# Altium schematic sheet mbed-enablement-platform_F_2.SchDoc: Mbed EP - DAPLink
size A4; Date: 10/26/2017 12:01:20 PM; Revision: Firefly; SheetNumber: 2; SheetTotal: 4
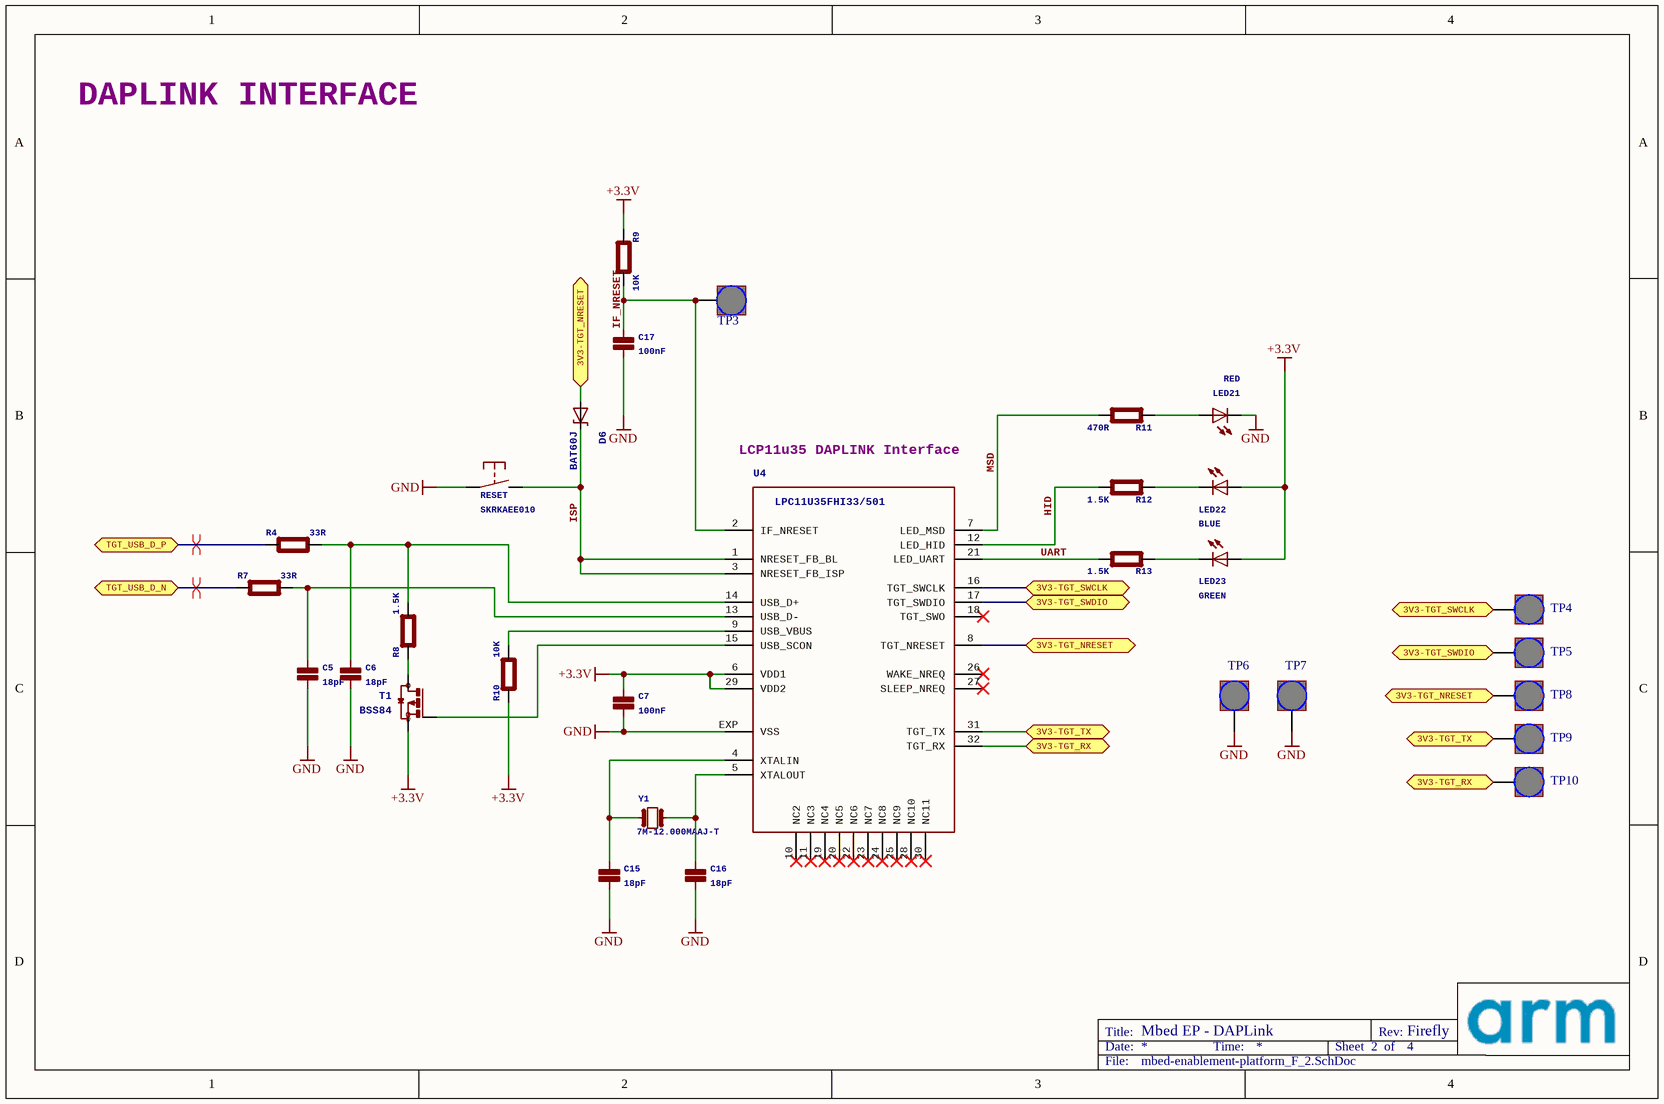
[diagram p0: mbed-enablement-platform_F_2.SchDoc]

## Parts
C5  18pF  [0402]
C6  18pF  [0402]
C7  100nF  [0402]
C15  18pF  [0402]
C16  18pF  [0402]
C17  100nF  [0402]
D6  BAT60J  [SOD323]
LED21  RED  [CHIPLED_0603]
LED22  BLUE  [CHIPLED_0603]
LED23  GREEN  [CHIPLED_0603]
R4  33R  [0402]
R7  33R  [0402]
R8  1.5K  [0402]
R9  10K  [0402]
R10  10K  [0402]
R11  470R  [0402]
R12  1.5K  [0402]
R13  1.5K  [0402]
RESET  SKRKAEE010  [SKRKAEE010]
T1  BSS84  [SOT23-3]
TP3  TP, 1.5mm  [TP1.5]  (value not drawn)
TP4  TP, 1.5mm  [TP1.5]  (value not drawn)
TP5  TP, 1.5mm  [TP1.5]  (value not drawn)
TP6  TP, 1.5mm  [TP1.5]  (value not drawn)
TP7  TP, 1.5mm  [TP1.5]  (value not drawn)
TP8  TP, 1.5mm  [TP1.5]  (value not drawn)
TP9  TP, 1.5mm  [TP1.5]  (value not drawn)
TP10  TP, 1.5mm  [TP1.5]  (value not drawn)
U4  IF_LPC11U35FHI33/501  [HVQFN33]  (value not drawn)
Y1  7M-12.000MAAJ-T  [3.2X.2.5]

## Ports
3V3-TGT_NRESET, 3V3-TGT_RX, 3V3-TGT_SWCLK, 3V3-TGT_SWDIO, 3V3-TGT_TX, TGT_USB_D_N (bidir), TGT_USB_D_P (bidir)

## Nets
+3.3V: C7.1(P$1) LED22.A LED23.A R9.1(P$1) R10.1(P$1) T1.2(S) U4.6(VDD1) U4.29(VDD2)
GND: C5.2(P$2) C6.2(P$2) C7.2(P$2) C15.2(P$2) C16.2(P$2) C17.2(P$2) LED21.C RESET.P$1(P) TP6.1 TP7.1 U4.EXP(VSS)
3V3-TGT_NRESET: D6.A TP8.1 U4.8(TGT_NRESET) ; port 3V3-TGT_NRESET
3V3-TGT_RX: TP10.1 U4.32(TGT_RX) ; port 3V3-TGT_RX
3V3-TGT_SWCLK: TP4.1 U4.16(TGT_SWCLK) ; port 3V3-TGT_SWCLK
3V3-TGT_SWDIO: TP5.1 U4.17(TGT_SWDIO) ; port 3V3-TGT_SWDIO
3V3-TGT_TX: TP9.1 U4.31(TGT_TX) ; port 3V3-TGT_TX
HID: R12.2(P$2) U4.12(LED_HID)
IF_NRESET: C17.1(P$1) R9.2(P$2) TP3.1 U4.2(IF_NRESET)
ISP: D6.K RESET.P$2(S) U4.1(NRESET_FB_BL) U4.3(NRESET_FB_ISP)
MSD: R11.2(P$2) U4.7(LED_MSD)
TGT_USB_D_N: R7.1(P$1) ; port TGT_USB_D_N
TGT_USB_D_P: R4.1(P$1) ; port TGT_USB_D_P
UART: R13.2(P$2) U4.21(LED_UART)
NetC5_1: C5.1(P$1) R7.2(P$2) U4.13(USB_D-)
NetC6_1: C6.1(P$1) R4.2(P$2) R8.2(P$2) U4.14(USB_D+)
NetC15_1: C15.1(P$1) U4.4(XTALIN) Y1.P$1
NetC16_1: C16.1(P$1) U4.5(XTALOUT) Y1.P$3
NetLED21_A: LED21.A R11.1(P$1)
NetLED22_C: LED22.C R12.1(P$1)
NetLED23_C: LED23.C R13.1(P$1)
NetR8_1: R8.1(P$1) T1.3(D)
NetR10_2: R10.2(P$2) U4.9(USB_VBUS)
NetT1_1: T1.1(G) U4.15(USB_SCON)

Not connected (* = marked no-connect by the designer): U4 10(NC2)* 11(NC3)* 18(TGT_SWO)* 19(NC4)* 20(NC5)* 22(NC6)* 23(NC7)* 24(NC8)* 25(NC9)* 26(WAKE_NREQ)* 27(SLEEP_NREQ)* 28(NC10)* 30(NC11)*

## Layout directives
differential pair: TGT_USB_D_N, TGT_USB_D_P

## Notes on the sheet
- DAPLINK INTERFACE
- LCP11u35 DAPLINK Interface
- Title:
- Date:
- Time:
- Sheet
- Rev:
- of
- File:

## Library data of the parts
C5-C7 C15-C17 = CAPACITOR0402: Capacitor
D6 = BAT60J: SCHOTTKY DIODE; MF: STMicroelectronics; MFN: BAT60JFILM; OC-DIGIKEY: 497-3707-6-ND; OC-MOUSER: 511-BAT60JFILM; OC-NEWARK: 89K1218
LED21-LED23 = SMD_LED0603: LED SMD, Colour Red; MF: Wurth Electronics Inc; MFN: 150060RS75000; OC-DIGIKEY: 732-4978-1-ND; OC-MOUSER: 710-150060RS75000; OC-NEWARK: 2322071
R4 R7-R13 = RESISTOR0402: Resistor
RESET = SKRKAEE010: MOMENTARY SWITCH PUSH VERTICAL (SPST); MF: ALPS; MFN: SKRKAEE010; OC-DIGIKEY: *; OC-MOUSER: 688-SKRKAE; OC-NEWARK: *
T1 = BSS84: MOSFET P-CHANNEL; MF: Fairchild Semiconductor; MFN: BSS84; OC-DIGIKEY: BSS84CT-ND; OC-MOUSER: 512-BSS84; OC-NEWARK: 58K8770
TP3-TP10 = TP1.5: 1.5mm round test point
U4 = IF_LPC11U35FHI33/501: CMSIS-DAP Interface : 32-bit LPC11U00 ARM Cortex M3 RISC 64KB Flash 2.5V/3.3V 33-Pin HVQFN EP; MF: NXP; MFN: LPC11U35FHI33/501; OC-DIGIKEY: 568-9586-ND; OC-MOUSER: 771-LPC11U35FHI33501; OC-NEWARK: 2115658; LPC11U35FHI33/501: LPC11U35FHI33/501
Y1 = 7M-12.000MAAJ-T: Crystal, TXC 12MHz Â±30ppm 18pF; MF: TXC; MFN: 7M-12.000MAAJ-T; OC-DIGIKEY: 887-1121-1-ND; OC-MOUSER: 717-7M-12.000MAAJ-T; OC-NEWARK: 84R5706